# Altium schematic sheet [02] - Sensor.SchDoc
size A
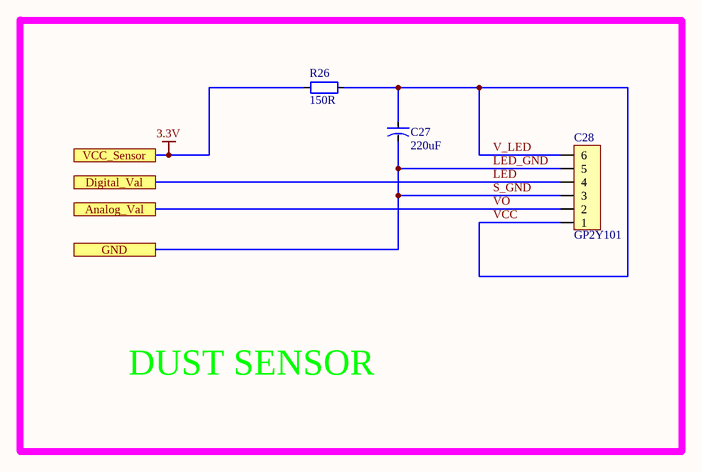
[diagram p0: [02] - Sensor.SchDoc]

## Parts
C27  220uF  [CAP-ALU-SMD-D]
C28  GP2Y101  [CON_6P]
R26  150R  [RES-SMD-0603]

## Ports
Analog_Val, Digital_Val, GND, VCC_Sensor

## Nets
3.3V: R26.1 ; port VCC_Sensor
LED: C28.4 ; port Digital_Val
LED_GND: C27.2 C28.3 C28.5 ; port GND  [also labelled S_GND]
V_LED: C27.1 C28.1 C28.6 R26.2  [also labelled VCC]
VO: C28.2 ; port Analog_Val

## Notes on the sheet
- DUST SENSOR

## Library data of the parts
C27 = CAP-ALU-SMD: Polarized Capacitor (Axial); Published: 8-Jun-2000; LatestRevisionDate: 17-Jul-2002; LatestRevisionNote: Re-released for DXP Platform.; PackageReference: POLAR0.8; Publisher: Altium Limited
C28 = Header6: Header IDC, 6 x 1 Pin Vertical 2.54mm Pitch (Non-Boxed, Male); Manufacturer: W¨¹rth Elektronik eiSos GmbH; partNo: 613002143121; ComponentLink1 Description: Manufacturer; ComponentLink2 Description: Datasheet; NoPins: 02; Created Date: 29 March 2013; ComponentLink1URL: http://www.we-online.com; ComponentLink2URL: http://katalog.we-online.de/em/datasheet/6130xx143121.pdf; Created by: Karrer Zheng
R26 = Resistor - SMD: Resistor; Manufacturer: Generic Components; Class: Passive; Published: 08/06/2000; Publisher: Altium Hobart Technology Centre